# Altium schematic sheet l298.SchDoc
size A
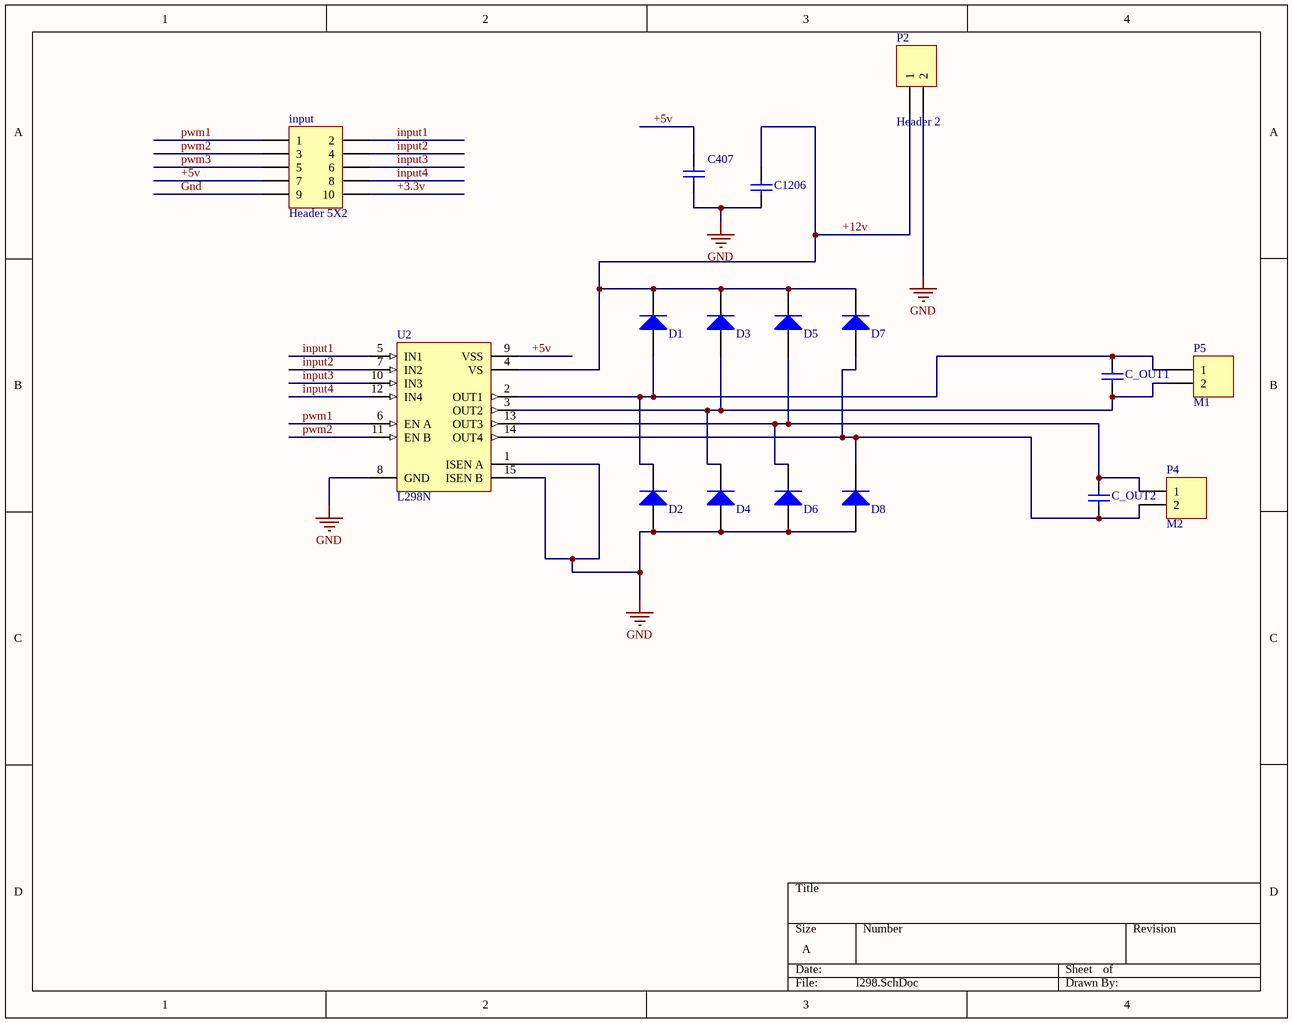
[diagram p0: l298.SchDoc]

## Parts
C407  Cap  [CAP470]  (value not drawn)
C1206  Cap  [1206]  (value not drawn)
C_OUT1  Cap  [1206]  (value not drawn)
C_OUT2  Cap  [1206]  (value not drawn)
D1  Diode 1N4001  [1N4007]  (value not drawn)
D2  Diode 1N4001  [1N4007]  (value not drawn)
D3  Diode 1N4001  [1N4007]  (value not drawn)
D4  Diode 1N4001  [1N4007]  (value not drawn)
D5  Diode 1N4001  [1N4007]  (value not drawn)
D6  Diode 1N4001  [1N4007]  (value not drawn)
D7  Diode 1N4001  [1N4007]  (value not drawn)
D8  Diode 1N4001  [1N4007]  (value not drawn)
input  Header 5X2  [HDR2X5]
P2  Header 2  [POWER2_NEW]
P4  M2  [POWER2_NEW]
P5  M1  [POWER2_NEW]
U2  L298N  [Multiwatt15V]

## Nets
Gnd: C407.1 C1206.1 D2.1(A) D4.1(A) D6.1(A) D8.1(A) input.9 P2.2 U2.1(ISEN_A) U2.8(GND) U2.15(ISEN_B)
+3.3v: input.10
+5v: C407.2 input.7 U2.9(VSS)
+12v: C1206.2 D1.2(K) D3.2(K) D5.2(K) D7.2(K) P2.1 U2.4(VS)
input1: input.2 U2.5(IN1)
input2: input.4 U2.7(IN2)
input3: input.6 U2.10(IN3)
input4: input.8 U2.12(IN4)
pwm1: input.1 U2.6(EN_A)
pwm2: input.3 U2.11(EN_B)
pwm3: input.5
NetC_OUT1_1: C_OUT1.1 D3.1(A) D4.2(K) P5.2 U2.3(OUT2)
NetC_OUT1_2: C_OUT1.2 D1.1(A) D2.2(K) P5.1 U2.2(OUT1)
NetC_OUT2_1: C_OUT2.1 D7.1(A) D8.2(K) P4.2 U2.14(OUT4)
NetC_OUT2_2: C_OUT2.2 D5.1(A) D6.2(K) P4.1 U2.13(OUT3)

## Library data of the parts
C407 C1206 C_OUT1 C_OUT2 = Cap: Capacitor; Value: 100pF; Published: 8-Jun-2000; LatestRevisionDate: 17-Jul-2002; LatestRevisionNote: Re-released for DXP Platform.; PackageReference: RAD-0.3; Publisher: Altium Limited; PackageDescription: Radial Cap, Thru-Hole; 2 Leads; 0.3 in Pin Spacing
D1-D8 = Diode 1N4001: 1 Amp General Purpose Rectifier; Published: 8-Jun-2000; LatestRevisionDate: 17-Jul-2002; LatestRevisionNote: Re-released for DXP Platform.; DatasheetVersion: 1998; PackageVersion: Aug-1999; PackageReference: DO-41; Publisher: Altium Limited; Code_JEDEC: DO-204-AL; ComponentLink1Description: Manufacturer Link; ComponentLink1URL: http://www.fairchildsemi.com/; ComponentLink2Description: Datasheet; ComponentLink2URL: http://www.fairchildsemi.com/ds/1N%2F1N4001.pdf
input = Header 5X2: Header, 5-Pin, Dual row; LatestRevisionDate: 17-Jul-2002; LatestRevisionNote: Re-released for DXP Platform.; Publisher: Altium Limited
P2 P4 P5 = Header 2: Header, 2-Pin; LatestRevisionDate: 17-Jul-2002; LatestRevisionNote: Re-released for DXP Platform.; Publisher: Altium Limited
U2 = L298N: Dual Full Bridge Driver; Published: 8-Jun-2000; LatestRevisionDate: 14-May-2007; LatestRevisionNote: Mapped to vertical PCB.; DatasheetVersion: Jul-1999; PackageReference: Multiwatt15V; Publisher: Altium Limited; PackageDescription: TO, Thru-Hole, Vertical, Heatsink Mounted; 15 Bent Staggered Leads; Pitch 1.27 mm; ComponentLink1Description: Manufacturer Link; ComponentLink1URL: http://www.st.com/; ComponentLink2Description: Datasheet; ComponentLink2URL: http://www.st.com/stonline/products/literature/ds/1773/l298.pdf